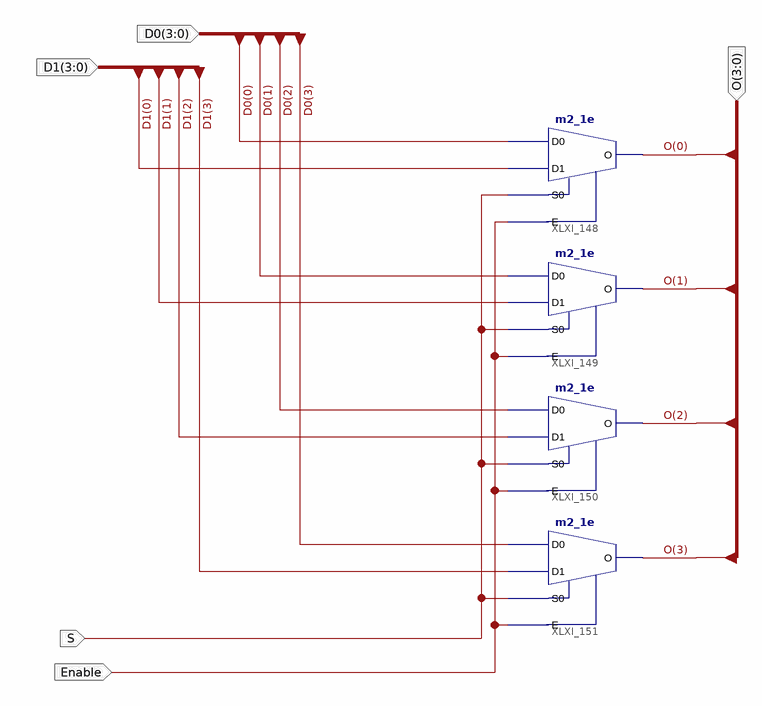
[diagram p0: schematic sheet 1]
// Xilinx ISE schematic mux2x1x4e.sch (spartan6) as structural Verilog: 4 symbols, 5 ports
module mux2x1x4e (
  input  [3:0] D0,
  input  [3:0] D1,
  input  Enable,
  input  S,
  input  [3:0] O
);

  m2_1e XLXI_148 (.D0(D0[0]), .D1(D1[0]), .E(Enable), .S0(S), .O(O[0]));
  m2_1e XLXI_149 (.D0(D0[1]), .D1(D1[1]), .E(Enable), .S0(S), .O(O[1]));
  m2_1e XLXI_150 (.D0(D0[2]), .D1(D1[2]), .E(Enable), .S0(S), .O(O[2]));
  m2_1e XLXI_151 (.D0(D0[3]), .D1(D1[3]), .E(Enable), .S0(S), .O(O[3]));
endmodule
